# Altium project TNY275.PrjPcb
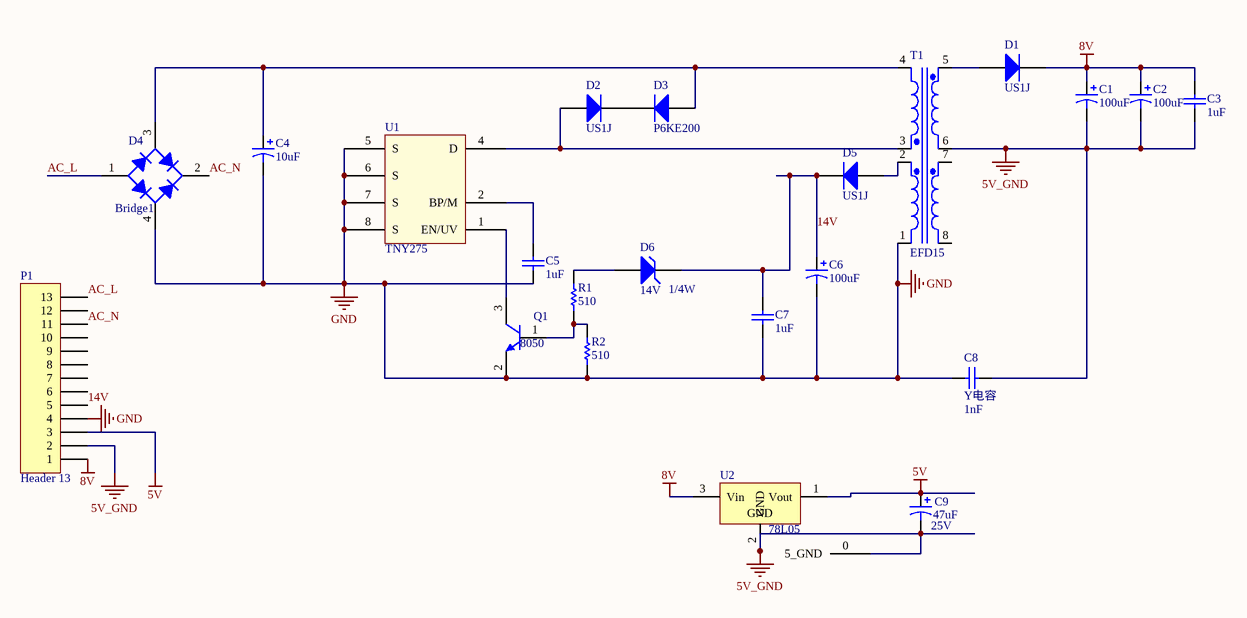
[diagram p0: TNY275_V1.SchDoc]
1 sheet, 22 parts. Net scope: global (net labels, ports and power ports of the same name join across sheets).
Board files: TNY275_V1.PcbDoc, TNY275_V11.PcbDoc

## Sheet TNY275_V1.SchDoc
size A3

### Parts
C1  value 100uF  [C-5*7]  (hidden comment: Cap Pol1)
C2  value 100uF  [C-5*7]  (hidden comment: Cap Pol1)
C3  value 1uF  [0805]  (hidden comment: Cap)
C4  value 10uF  [C-10 卧式]  (hidden comment: Cap Pol1)
C5  value 1uF  [0805]  (hidden comment: Cap)
C6  value 100uF  [电解电容6*11mm-脚距2.5mm]  (hidden comment: Cap Pol1)
C7  value 1uF  [0805]  (hidden comment: Cap)
C8  Y电容  value 1nF  [07D471K]
C9  25V  value 47uF  [1206]
D1  US1J  [SMA]
D2  US1J  [SMA]
D3  P6KE200  [SMBJ]
D4  Bridge1  [MB10S]
D5  US1J  [SMA]
D6  14V  a: 1/4W  [1206]
P1  Header 13  [2.54引脚]
Q1  8050  [sot-23]
R1  value 510  [0805]  (hidden comment: Res1)
R2  value 510  [0805]  (hidden comment: Res1)
T1  EFD15  [EFD15_DIP8]
U1  TNY275  [TNY275_SMD]
U2  78L05  [SOT89]

### Nets
5V: C9.1 P1.3 U2.1(Vout)
5V_GND: C1.2 C2.2 C3.1 C8.2 C9.2 P1.2 T1.6(Sec1-) U2.0(5_GND) U2.2(GND)
8V: C1.1 C2.1 C3.2 D1.2(K) P1.1 U2.3(Vin)
GND: C4.2 C5.1 C6.2 C7.1 C8.1 D4.4(-) P1.4 Q1.2(E) R2.2 T1.1(Pri2-) U1.5(S) U1.6(S) U1.7(S) U1.8(S)
14V: C6.1 C7.2 D5.2(K) D6.2(K) P1.5
AC_L: D4.1(AC) P1.13
AC_N: D4.2(AC) P1.11
NetC4_1: C4.1 D3.1(A) D4.3(+) T1.4(Pri1+)
NetC5_2: C5.2 U1.2(BP/M)
NetD1_1: D1.1(A) T1.5(Sec1+)
NetD2_1: D2.1(A) T1.3(Pri1-) U1.4(D)
NetD2_2: D2.2(K) D3.2(K)
NetD5_1: D5.1(A) T1.2(Pri2+)
NetD6_1: D6.1(A) R1.1
NetQ1_1: Q1.1(B) R1.2 R2.1
NetQ1_3: Q1.3(C) U1.1(EN/UV)

Not connected (* = marked no-connect by the designer): P1 6 7 8 9 10 12; T1 7(Sec2+) 8(Sec2-)

### Library data of the parts
C1 C2 C4 C6 C9 = Cap Pol1: Polarized Capacitor (Radial); Published: 8-Jun-2000; LatestRevisionDate: 17-Jul-2002; LatestRevisionNote: Re-released for DXP Platform.; PackageReference: RB7.6-15; Publisher: Altium Limited
C3 C5 C7 C8 = Cap: Capacitor; Published: 8-Jun-2000; LatestRevisionDate: 17-Jul-2002; LatestRevisionNote: Re-released for DXP Platform.; PackageReference: RAD-0.3; Publisher: Altium Limited
D1 D5 = Diode 1N4007: 1 Amp General Purpose Rectifier; Published: 8-Jun-2000; LatestRevisionDate: 17-Jul-2002; LatestRevisionNote: Re-released for DXP Platform.; DatasheetVersion: 1998; PackageVersion: Aug-1999; PackageReference: DO-41; Publisher: Altium Limited; Code_JEDEC: DO-204-AL; ComponentLink1Description: Manufacturer Link; ComponentLink1URL: http://www.fairchildsemi.com/; ComponentLink2Description: Datasheet; ComponentLink2URL: http://www.fairchildsemi.com/ds/1N%2F1N4001.pdf
D2 D3 = Diode: Default Diode; Published: 8-Jun-2000; LatestRevisionDate: 17-Jul-2002; LatestRevisionNote: Re-released for DXP Platform.; PackageVersion: Sep-1996; PackageReference: SMC; Publisher: Altium Limited; Code_JEDEC: DO-214-AB
D4 = Bridge1: Full Wave Diode Bridge; Published: 8-Jun-2000; LatestRevisionDate: 17-Jul-2002; LatestRevisionNote: Re-released for DXP Platform.; PackageReference: D-38; Publisher: Altium Limited
D6 = D Zener: Zener Diode; Published: 8-Jun-2000; LatestRevisionDate: 17-Jul-2002; LatestRevisionNote: Re-released for DXP Platform.; PackageReference: DIODE-0.7; Publisher: Altium Limited
P1 = Header 13: Header, 13-Pin; LatestRevisionDate: 17-Jul-2002; LatestRevisionNote: Re-released for DXP Platform.; Publisher: Altium Limited
Q1 = NPN: NPN Bipolar Transistor; Published: 8-Jun-2000; LatestRevisionDate: 17-Jul-2002; LatestRevisionNote: Re-released for DXP Platform.; PackageReference: TO-226; Publisher: Altium Limited; Code_JEDEC: TO-226-AA
R1 R2 = Res1: Resistor; Published: 8-Jun-2000; LatestRevisionDate: 17-Jul-2002; LatestRevisionNote: Re-released for DXP Platform.; PackageReference: AXIAL-0.3; Publisher: Altium Limited
U2 = Volt Reg: Voltage Regulator; Published: 24-Mar-1999; LatestRevisionDate: 17-Jul-2002; LatestRevisionNote: Re-released for DXP Platform.; PackageReference: D2PAK; Publisher: Altium Limited; Code_JEDEC: SMD-220